# EAGLE design 9xVoice MikeB SMD v1.0c (EAGLE 6.5.0)
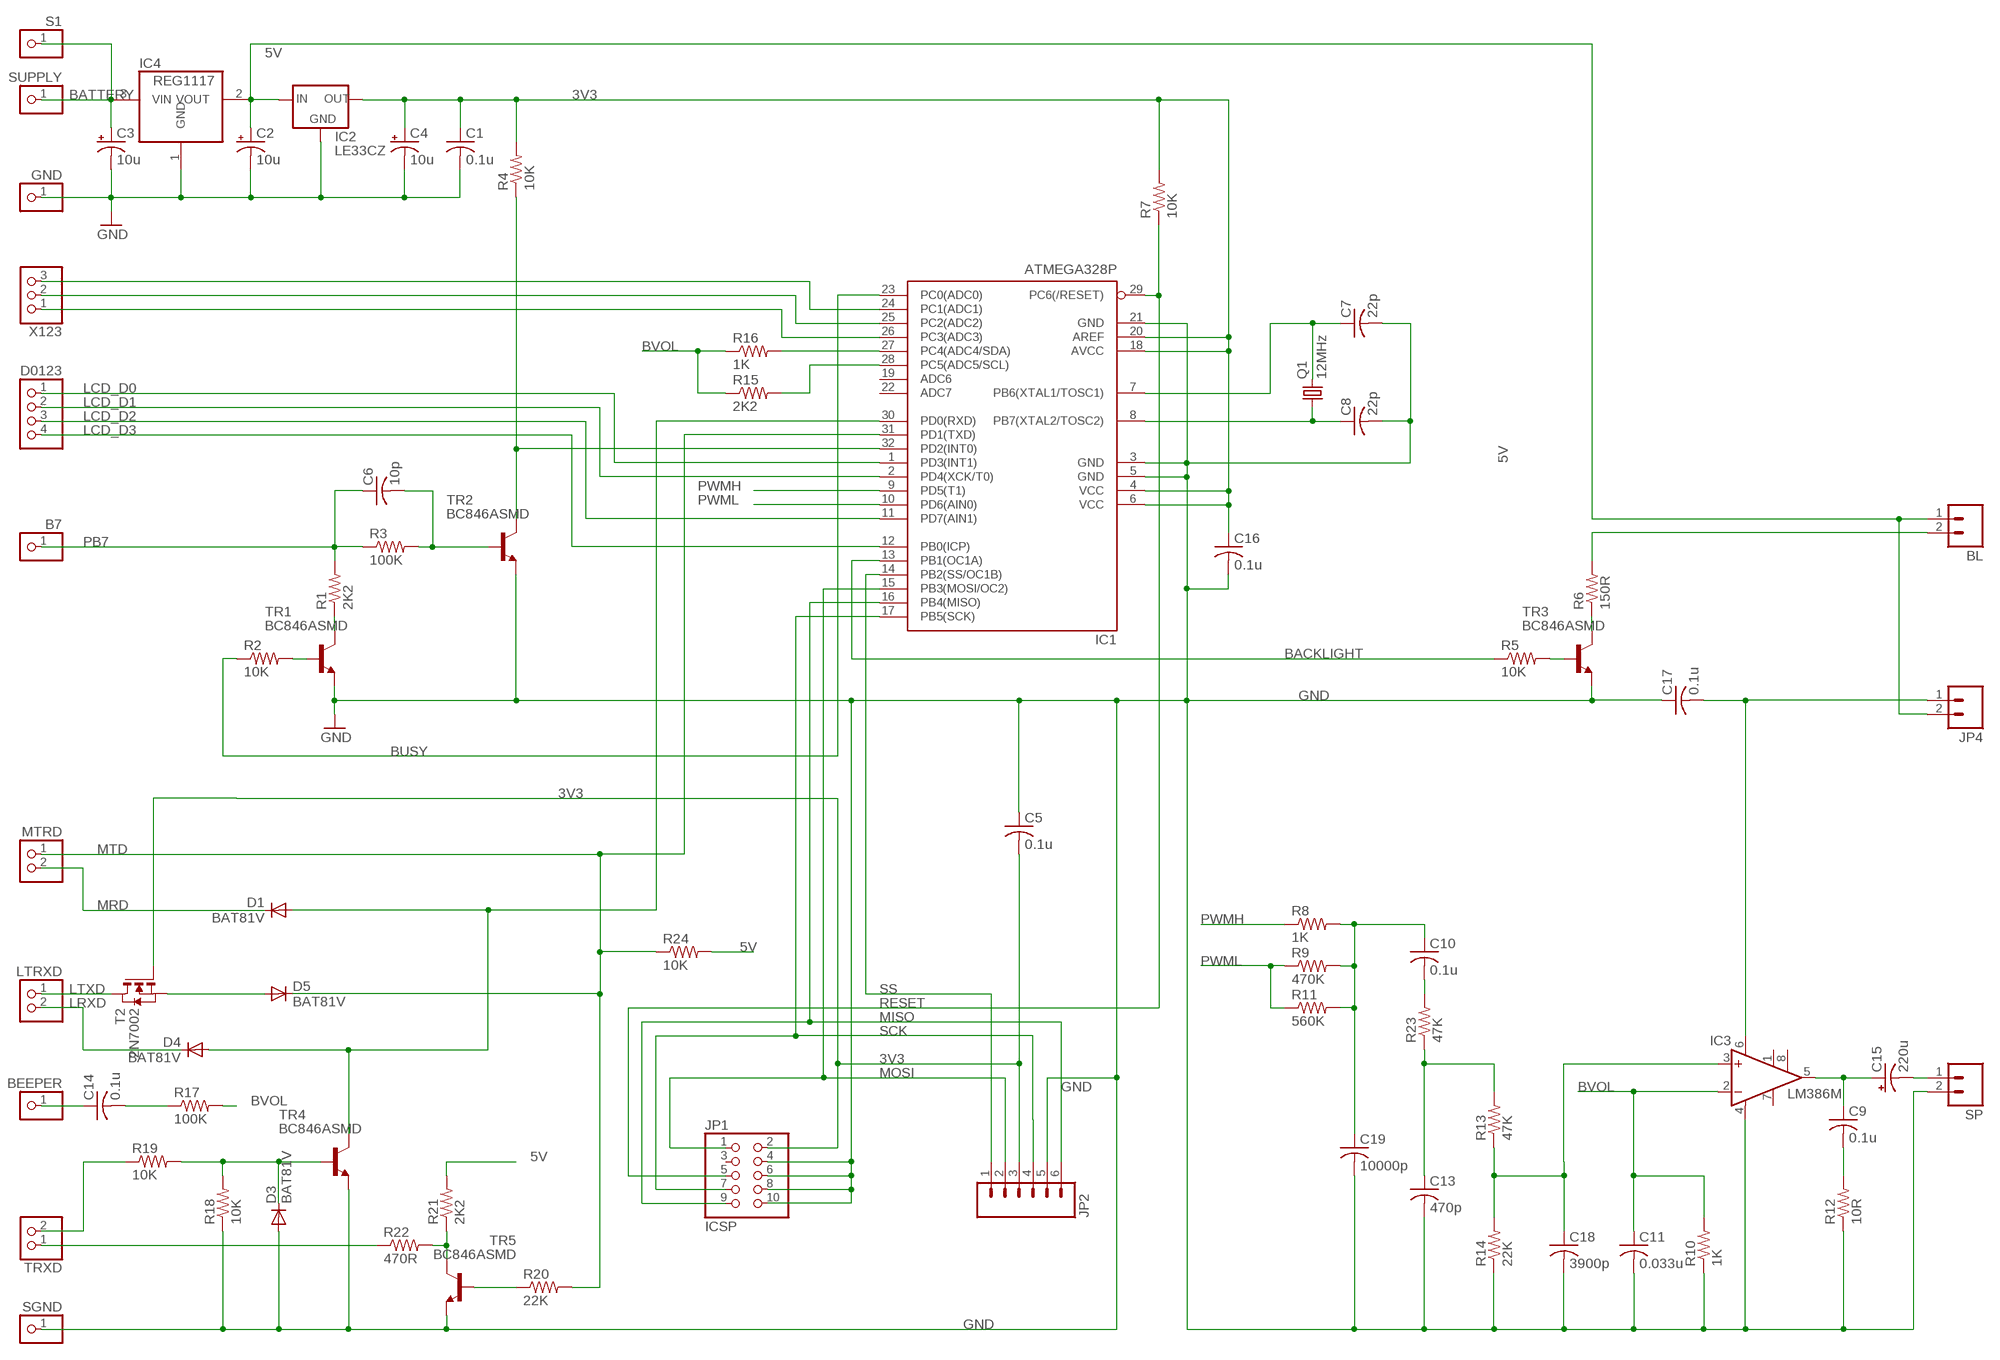
[diagram p0: schematic, sheet 1]

## Parts
B7  PINHD-1X1  [1X01]
BEEPER  PINHD-1X1  [1X01]
BL  M02PTH  [1X02]
C1  0.1u  C-USC1206  [C1206]
C2  10u  CPOL-USA/3216-18R  [A/3216-18R]
C3  10u  CPOL-USA/3216-18R  [A/3216-18R]
C4  10u  CPOL-USA/3216-18R  [A/3216-18R]
C5  0.1u  C-USC1206  [C1206]
C6  10p  C-USC1206  [C1206]
C7  22p  C-USC1206  [C1206]
C8  22p  C-USC1206  [C1206]
C9  0.1u  C-USC1206  [C1206]
C10  0.1u  C-USC1206  [C1206]
C11  0.033u  C-USC1206  [C1206]
C13  470p  C-USC1206  [C1206]
C14  0.1u  C-USC1206  [C1206]
C15  220u  CPOL-USCT7343  [CT7343]
C16  0.1u  C-USC1206  [C1206]
C17  0.1u  C-USC1206  [C1206]
C18  3900p  C-USC1206  [C1206]
C19  10000p  C-USC1206  [C1206]
D1  BAT81V  DIODE-SOD123  [SOD123]
D3  BAT81V  DIODE-SOD123  [SOD123]
D4  BAT81V  DIODE-SOD123  [SOD123]
D5  BAT81V  DIODE-SOD123  [SOD123]
D0123  PINHD-1X4  [1X04]
GND  PINHD-1X1  [1X01]
IC1  ATMEGA328P  MEGA8-AI  [TQFP32-08]
IC2  LE33CZ  XC63FPM  [SOT23]
IC3  LM386M  LM386M-1  [SO08]
IC4  REG1117  [SOT223]
JP1  ICSP  PINHD-2X5  [2X05]
JP2  M06SIP  [1X06]
JP4  M02PTH  [1X02]
LTRXD  PINHD-1X2  [1X02]
MTRD  PINHD-1X2  [1X02]
Q1  12MHz  7A  [2-SMD]
R1  2K2  R-US_R1206  [R1206]
R2  10K  R-US_R1206  [R1206]
R3  100K  R-US_R1206  [R1206]
R4  10K  R-US_R1206  [R1206]
R5  10K  R-US_R1206  [R1206]
R6  150R  R-US_R1206  [R1206]
R7  10K  R-US_R1206  [R1206]
R8  1K  R-US_R1206  [R1206]
R9  470K  R-US_R1206  [R1206]
R10  1K  R-US_R1206  [R1206]
R11  560K  R-US_R1206  [R1206]
R12  10R  R-US_R1206  [R1206]
R13  47K  R-US_R1206  [R1206]
R14  22K  R-US_R1206  [R1206]
R15  2K2  R-US_R1206  [R1206]
R16  1K  R-US_R1206  [R1206]
R17  100K  R-US_R1206  [R1206]
R18  10K  R-US_R1206  [R1206]
R19  10K  R-US_R1206  [R1206]
R20  22K  R-US_R1206  [R1206]
R21  2K2  R-US_R1206  [R1206]
R22  470R  R-US_R1206  [R1206]
R23  47K  R-US_R1206  [R1206]
R24  10K  R-US_R1206  [R1206]
S1  PINHD-1X1  [1X01]
SGND  PINHD-1X1  [1X01]
SP  M02PTH  [1X02]
SUPPLY  PINHD-1X1  [1X01]
T2  2N7002  NMOSSOT23  [SOT-23]
TR1  BC846ASMD  [SOT23]
TR2  BC846ASMD  [SOT23]
TR3  BC846ASMD  [SOT23]
TR4  BC846ASMD  [SOT23]
TR5  BC846ASMD  [SOT23]
TRXD  PINHD-1X2  [1X02]
X123  PINHD-1X3  [1X03]

## Nets
3V3: C1.1 C4.+ C5.2 C16.1 IC1.4(VCC) IC1.6(VCC) IC1.18(AVCC) IC1.20(AREF) IC2.2(OUT) JP1.2 JP2.3 R4.2 R7.2 T2.3(G)
5V: BL.1 C2.+ IC2.3(IN) IC4.2(VOUT) JP4.2 R21.2 R24.2
BACKLIGHT: IC1.13(PB1(OC1A)) R5.1
BATTERY: C3.+ IC4.3(VIN) S1.1 SUPPLY.1
BEEPER: BEEPER.1 C14.1
BUSY: IC1.23(PC0(ADC0)) R2.1
BVOL: C11.1 IC3.2(-IN) R10.2 R15.1 R16.1 R17.2
GND: C1.2 C2.- C3.- C4.- C5.1 C7.2 C8.2 C11.2 C13.2 C16.2 C17.1 C18.2 C19.2 D3.A GND.1 IC1.3(GND) IC1.5(GND) IC1.21(GND) IC2.1(GND) IC3.4(GND) IC4.1(GND) JP1.4 JP1.6 JP1.8 JP1.10 JP2.5 R10.1 R12.1 R14.1 R18.1 SGND.1 SP.2 TR1.2(E) TR2.2(E) TR3.2(E) TR4.2(E) TR5.2(E)
LCD_D0: D0123.1 IC1.1(PD3(INT1))
LCD_D1: D0123.2 IC1.2(PD4(XCK/T0))
LCD_D2: D0123.3 IC1.11(PD7(AIN1))
LCD_D3: D0123.4 IC1.12(PB0(ICP))
LRXD: D4.C LTRXD.2
LTXD: LTRXD.1 T2.1(D)
MISO: IC1.16(PB4(MISO)) JP1.9 JP2.6
MOSI: IC1.15(PB3(MOSI/OC2)) JP1.1 JP2.2
MRD: D1.C MTRD.2
MTD: D5.C IC1.31(PD1(TXD)) MTRD.1 R20.2 R24.1
N$1: C13.1 R13.2 R23.1
N$2: R21.1 R22.2 TR5.3(C)
N$3: R22.1 TRXD.1
N$4: R20.1 TR5.1(B)
N$5: IC1.28(PC5(ADC5/SCL)) R15.2
N$6: IC1.27(PC4(ADC4/SDA)) R16.2
N$10: R19.1 TRXD.2
N$11: D3.C R18.2 R19.2 TR4.1(B)
N$14: D5.A T2.2(S)
N$21: R1.1 TR1.3(C)
N$22: R2.2 TR1.1(B)
N$23: C6.2 R3.2 TR2.1(B)
N$25: C14.2 R17.1
N$26: R5.2 TR3.1(B)
N$27: R6.1 TR3.3(C)
N$28: C10.2 R23.2
N$29: IC1.32(PD2(INT0)) R4.1 TR2.3(C)
N$30: C8.1 IC1.8(PB7(XTAL2/TOSC2)) Q1.P$1
N$31: C7.1 IC1.7(PB6(XTAL1/TOSC1)) Q1.P$2
N$33: BL.2 R6.2
N$34: C9.1 C15.+ IC3.5(OUT)
N$35: C9.2 R12.2
N$36: C15.- SP.1
N$37: C17.2 IC3.6(VS) JP4.1
N$39: C10.1 C19.1 R8.2 R9.2 R11.2
N$40: C18.1 IC3.3(+IN) R13.1 R14.2
PB7: B7.1 C6.1 R1.2 R3.1
PWMH: IC1.9(PD5(T1)) R8.1
PWML: IC1.10(PD6(AIN0)) R9.1 R11.1
RESET: IC1.29(PC6(/RESET)) JP1.5 R7.1
RXD: D1.A D4.A IC1.30(PD0(RXD)) TR4.3(C)
SCK: IC1.17(PB5(SCK)) JP1.7 JP2.4
SS: IC1.14(PB2(SS/OC1B)) JP2.1
X1: IC1.26(PC3(ADC3)) X123.1
X2: IC1.25(PC2(ADC2)) X123.2
X3: IC1.24(PC1(ADC1)) X123.3
Unconnected: IC1.19(ADC6) IC1.22(ADC7) IC3.1(GAIN) IC3.7(BYPASS) IC3.8(GAIN) JP1.3

## Library data of the parts
B7 BEEPER GND S1 SGND SUPPLY = pinhead:PINHD-1X1: PIN HEADER
BL JP4 SP = SparkFun-Connectors:M02: Header 2 Standard 2-pin 0.1" header. Use with straight break away headers (SKU : PRT-00116), right angle break away headers (PRT-00553), swiss pins (PRT-00743), machine pins (PRT-00117), and female headers (PRT-00115). Molex polarized connector foot print use with SKU : PRT-08233 with associated crimp pins and housings.
C1 C5-C11 C13 C14 C16-C19 = jdc:C-US: CAPACITOR, American symbol
C2-C4 C15 = jdc:CPOL-US: POLARIZED CAPACITOR, American symbol
D1 D3-D5 = jdc:DIODE-: DIODE
D0123 = jdc:PINHD-1X4
IC1 = atmel:MEGA8: MICROCONTROLLER 8 Kbytes FLASH, 1 kbytes SRAM, 512 bytes EEPROM, USART, 6-channel 10 bit ADC, 2-channel 8 bit ADC Pin compatible with Atmega48, ATMega88, ATMega168 Source: avr.lbr; MPN: ATMEGA8-16AU; OC_FARNELL: 9171371; OC_NEWARK: 73M8863
IC2 = v-reg:XC63FP: Positiv Voltage Regulators www.torex.co.jp/english/product/pro02/pdf/0201_xc62fp.pdf
IC3 = jdc:LM386?-*: Low Voltage Audio Power Amplifier Source: http://cache.national.com/ds/LM/LM386.pdf
IC4 = burr-brown:REG1117: 800mA and 1A Low Dropout (LDO) Positive Regulator 1.8V, 2.5V, 2.85V, 3.3V, 5V, and Adj; MPN: REG1117; OC_FARNELL: 1097566; OC_NEWARK: 14P6981
JP1 = pinhead:PINHD-2X5: PIN HEADER
JP2 = SparkFun-Connectors:M06: Header 6 Standard 6-pin 0.1" header. Use with straight break away headers (SKU : PRT-00116), right angle break away headers (PRT-00553), swiss pins (PRT-00743), machine pins (PRT-00117), and female headers (PRT-00115). Molex polarized connector foot print use with SKU : PRT-08094 with associated crimp pins and housings. NOTES ON THE VARIANTS LOCK and LOCK_LONGPADS... This footprint was designed to help hold the alignment of a through-hole component (i.e. 6-pin header) while soldering it into place. You may notice that each hole has been shifted either up or down by 0.005 of an inch from it's more standard position (which is a perfectly straight line). This slight alteration caused the pins (the squares in the middle) to touch the edges of the holes. Because they are alternating, it causes a "brace" to hold the component in place. 0.005 has proven to be the perfect amount of "off-center" position when using our standard breakaway headers. Although looks a little odd when you look at the bare footprint, once you have a header in there, the alteration is very hard to notice. Also, if you push a header all the way into place, it is covered up entirely on the bottom side. This idea of altering the position of holes to aid alignment will be further integrated into the Sparkfun Library for other footprints. It can help hold any component with 3 or more connection pins.
LTRXD MTRD TRXD = jdc:PINHD-1X2
Q1 = jdc:7A
R1-R24 = jdc:R-US_: RESISTOR, American symbol
T2 = zetex:NMOSSOT23: MOS FET; OC_FARNELL: unknown; OC_NEWARK: unknown
TR1-TR4 = jdc:BC846*: NPN Transistor
TR5 = transistor-npn:BC846*: NPN Transistor
X123 = jdc:PINHD-1X3: PIN HEADER

## Board
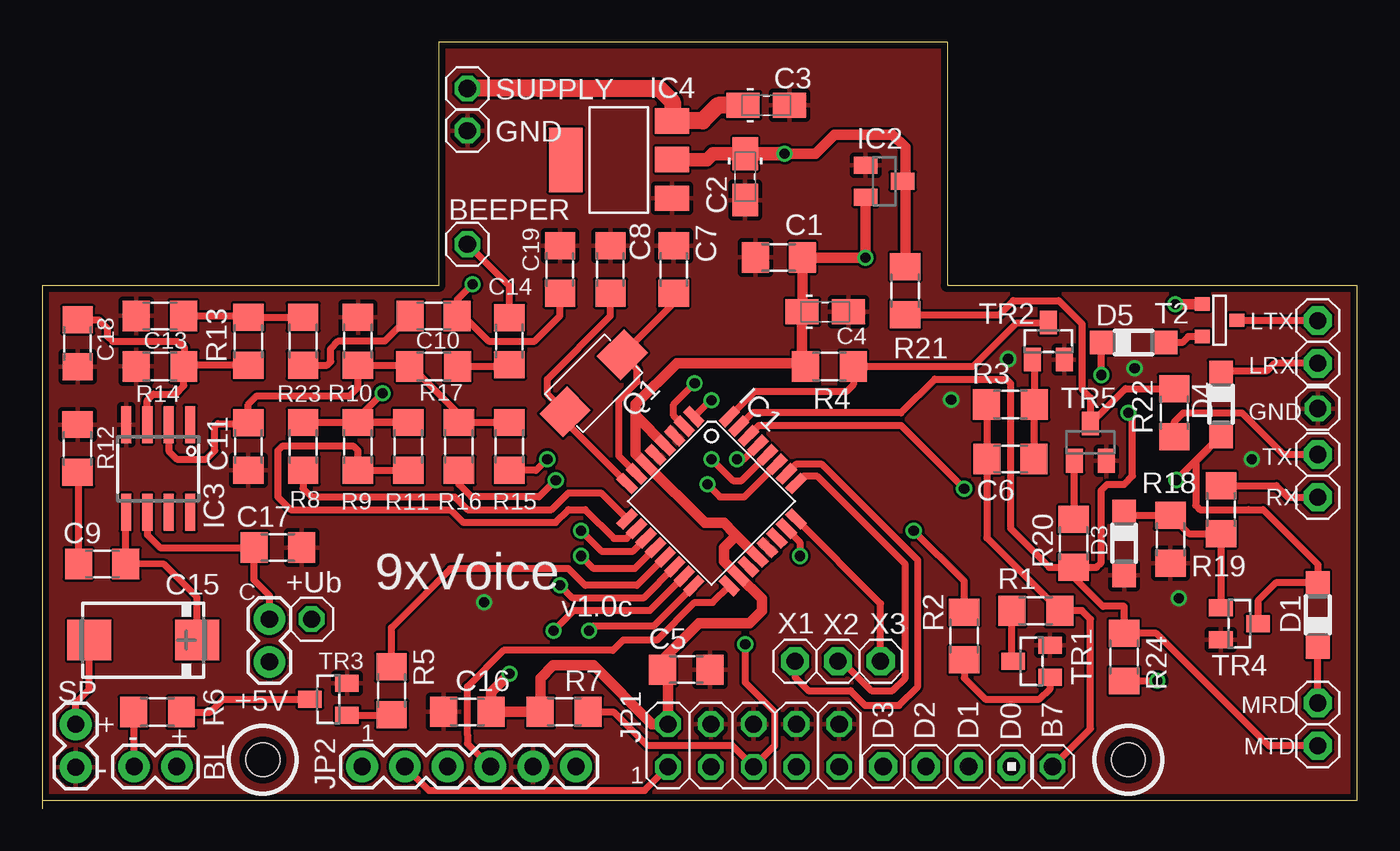
[diagram p1: board, top side]
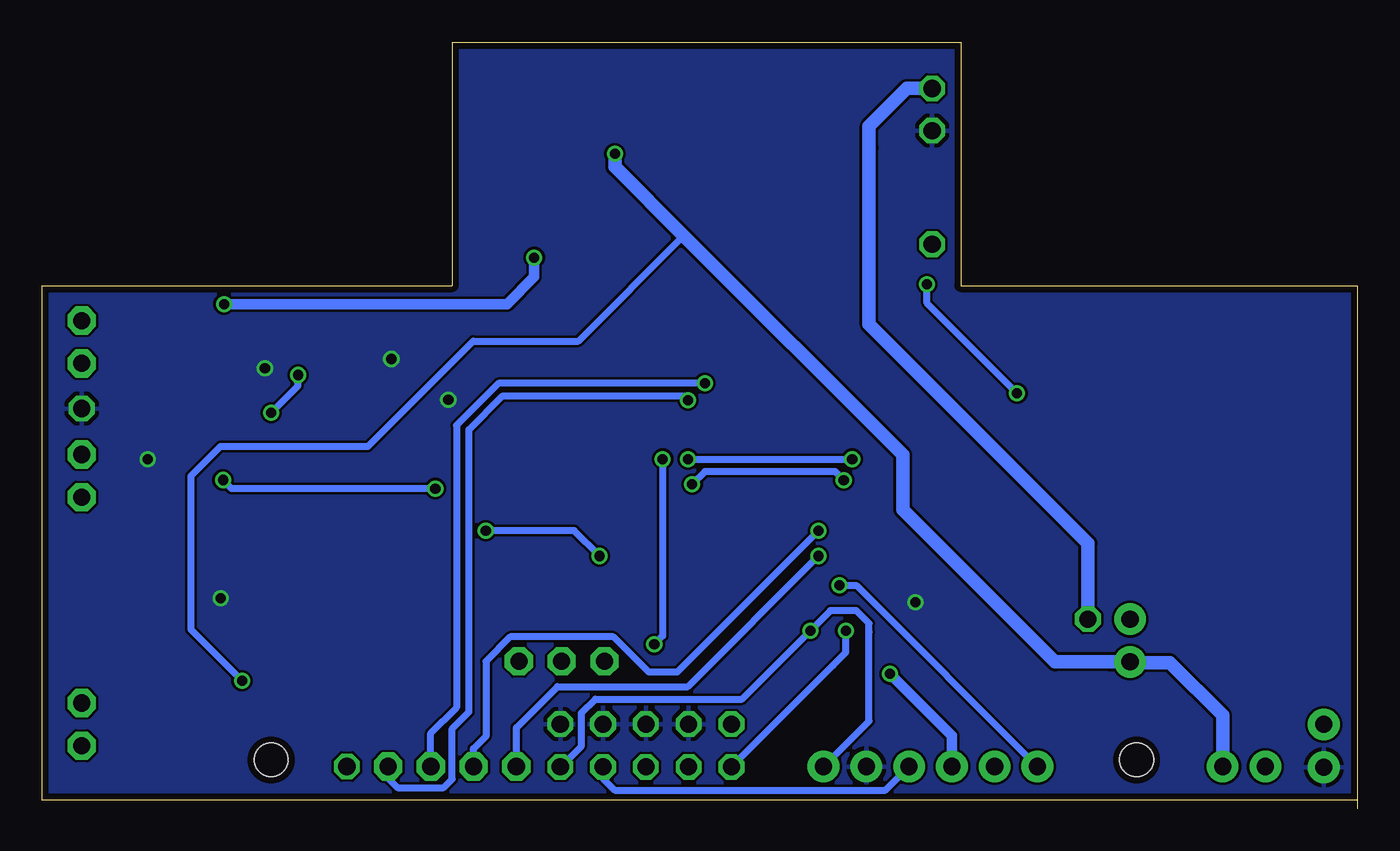
[diagram p2: board, bottom side, seen from below]

Size 78.1 x 45.5 mm. Coordinates in mm from the lower left corner, seen from the top.
Outline: 0,0.5 78.1,0.5 78.1,31.05 53.75,31.05 53.75,45.5 23.55,45.5 23.55,31.05 0,31.05 0,0.5
Outline: 0,0.5 0,0
Copper layers (1*16): Top 0.0356mm / dielectric 1.5011mm / Bottom 0.0356mm
Design rules "LaenPCBOrder *": minimum track width 6mil, minimum drill 13mil, track to track 6mil, track to pad 6mil, pad to pad 6mil, via to via 6mil, smd to smd 6mil, copper to edge 15mil, drill to drill 6mil, minimum pad ring 7mil, minimum via ring 7mil, stop-mask expansion 4mil, vias tented up to drill 24mil, thermal gap 10mil
Holes 2 mm at 13.1,2.9 64.5,2.9
tKeepout: area 11.1,0.9 to 15.1,4.9; area 62.5,0.9 to 66.5,4.9

### Footprints (pad centres in the part's own frame; a part is rotated, then mirrored left to right if it is on the bottom)
1X01 = drill 1.016 octagon: 1 0,0
1X02 = drill 1.016 pad 1.88: 1 0,0; 2 2.54,0
C1206 = smd 1.6 x 1.8: 1 -1.4,0; 2 1.4,0
A/3216-18R = smd 1.95 x 1.5: + 1.375,0; - -1.375,0
CT7343 = smd 2.6 x 2.4: + -3.2,0; - 3.2,0
SOD123 = smd 1.4 x 1.4: A 1.9,0; C -1.9,0
1X04 = drill 1.016 pad 1.676 octagon: 1 -3.81,0; 2 -1.27,0; 3 1.27,0; 4 3.81,0
TQFP32-08 = smd 1.27 x 0.559: 1 -4.293,2.8; 2 -4.293,2; 3 -4.293,1.2; 4 -4.293,0.4; 5 -4.293,-0.4; 6 -4.293,-1.2; 7 -4.293,-2; 8 -4.293,-2.8; 17 4.293,-2.8; 18 4.293,-2; 19 4.293,-1.2; 20 4.293,-0.4; 21 4.293,0.4; 22 4.293,1.2; 23 4.293,2; 24 4.293,2.8 | smd 0.559 x 1.27: 9 -2.8,-4.293; 10 -2,-4.293; 11 -1.2,-4.293; 12 -0.4,-4.293; 13 0.4,-4.293; 14 1.2,-4.293; 15 2,-4.293; 16 2.8,-4.293; 25 2.8,4.293; 26 2,4.293; 27 1.2,4.293; 28 0.4,4.293; 29 -0.4,4.293; 30 -1.2,4.293; 31 -2,4.293; 32 -2.8,4.293
SOT23 = smd 1 x 1.4: 1 -0.95,-1.1; 2 0.95,-1.1; 3 0,1.1
SO08 = smd 0.6 x 2.2: 1 -1.905,-2.6; 2 -0.635,-2.6; 3 0.635,-2.6; 4 1.905,-2.6; 5 1.905,2.6; 6 0.635,2.6; 7 -0.635,2.6; 8 -1.905,2.6
SOT223 = smd 1.499 x 2.007: 1 -2.261,-3.15; 2 0.025,-3.15; 3 2.311,-3.15 | smd 3.81 x 2.007: 4 0,3.15
2X05 = drill 1.016 octagon: 1 -5.08,-1.27; 2 -5.08,1.27; 3 -2.54,-1.27; 4 -2.54,1.27; 5 0,-1.27; 6 0,1.27; 7 2.54,-1.27; 8 2.54,1.27; 9 5.08,-1.27; 10 5.08,1.27
1X06 = drill 1.016 pad 1.88: 1 0,0; 2 2.54,0; 3 5.08,0; 4 7.62,0; 5 10.16,0; 6 12.7,0
1X02' = drill 1.016 pad 1.676 octagon: 1 -1.27,0; 2 1.27,0
2-SMD = smd 2.3 x 2: P$1 2.4,0; P$2 -2.4,0
R1206 = smd 1.6 x 1.803: 1 -1.422,0; 2 1.422,0
SOT-23 = smd 0.787 x 0.889: 1 0.025,-1.016; 2 -0.94,1.016; 3 0.991,1.016
1X03 = drill 1.016 pad 1.676 octagon: 1 -2.54,0; 2 0,0; 3 2.54,0

### Placement (x,y rotation side)
B7  60,2.5 0 top
BEEPER  25.25,33.5 0 top
BL  8,2.5 180 top
C1  43.75,32.72 180 top
C2  41.75,37.5 90 top
C3  43,41.75 180 top
C4  46.5,29.5 180 top
C5  38.25,8.25 180 top
C6  57.5,20.75 0 top
C7  37.5,32 90 top
C8  33.75,32 90 top
C9  3.57,14.53 180 top
C10  23.25,29.25 180 top
C11  12.25,21.5 270 top
C13  7,29.25 180 top
C14  27.75,27.75 270 top
C15  6,10 180 top
C16  25.25,5.75 180 top
C17  14,15.5 180 top
C18  2.11,27.62 270 top
C19  30.75,32 90 top
D1  75.75,11.5 90 top
D3  64.25,15.75 270 top
D4  70,24 270 top
D5  64.81,27.67 0 top
D0123  53.75,2.5 180 top
GND  25.25,40.25 0 top
IC1  39.75,18.25 315 top
IC2  50,37.25 270 top
IC3  6.89,20.19 180 top
IC4  34.25,38.5 90 top
JP1  42.25,3.75 0 top
JP2  19,2.5 0 top
JP4  13.5,11.25 270 top
LTRXD  [1X02']  75.75,27.7 270 top
MTRD  [1X02']  75.75,5 90 top
Q1  32.75,25.25 225 top
R1  59,11.75 0 top
R2  54.75,10.25 270 top
R3  57.5,24 0 top
R4  46.75,26.25 180 top
R5  20.75,7 270 top
R6  6.85,5.73 180 top
R7  31,5.75 180 top
R8  15.5,21.5 90 top
R9  18.75,21.5 90 top
R10  18.75,27.75 270 top
R11  21.75,21.5 90 top
R12  2.11,21.38 270 top
R13  12.25,27.75 90 top
R14  7,26.25 0 top
R15  27.75,21.5 270 top
R16  24.75,21.5 270 top
R17  23.25,26.25 180 top
R18  67,16 90 top
R19  70,17.75 270 top
R20  61.25,15.75 270 top
R21  51.25,30.75 90 top
R22  67.23,23.51 90 top
R23  15.5,27.75 270 top
R24  64.25,9 270 top
S1  16,11.25 0 top
SGND  75.75,23.75 0 top
SP  2,5 270 top
SUPPLY  25.25,42.75 0 top
T2  69.92,28.96 90 top
TR1  58.75,8.75 90 top
TR2  59.75,27.75 0 top
TR3  17,6.5 90 top
TR4  71.09,10.98 270 top
TR5  62.25,21.75 0 top
TRXD  [1X02']  75.75,19.75 270 top
X123  47.25,8.75 0 top

### Tracks (layer width: path | path; a pad name or v marks a point on that pad's centre or on a via)
3V3  (via drill 0.6)
  Top 0.61: 45.15,29.02 C4.+ | C4.+ 45.12,26.45 | 45.12,26.45 R4.2 | R7.2 C16.1 26.65,6.9 v27.75,8 | R7.2 | v67.3,29.95 T2.3 | 45.12,26.45 37.7,26.45 35.25,24 35.25,23.25 | R7.2 29.59,5.76 29.59,7.75 30.34,8.5 32.75,8.5 36.23,5.02 JP1.2 37.17,7.93 C5.2 36.85,8.85 39,11 42,11 42.74,11.74 42.74,12.45 41.39,13.8 IC1.18 40.5,14.67 40.5,15.5 41.09,16.09 41.09,16.34 | IC1.20 41.09,16.34 | 41.09,16.34 41.09,16.36 40.49,16.96 39.35,16.96 IC1.6 35.25,21.05 35.25,23.25 | IC1.4 35.32,23.25 35.25,23.25 | IC2.2 48.88,36.28 v48.88,32.71 C1.1 45.15,29.02 | 45.15,29.02 C4.+
  Bottom 0.61: v67.3,29.95 50.5,29.95 48.88,31.57 v48.88,32.71 | JP2.3 24.08,4.33 v27.75,8
5V  (via drill 0.6)
  Top 0.406: R24.2 66.23,7.58 v66.23,7.6
  Top 0.61: IC2.3 51.25,37.1 R21.2 51.25,39.25 50.5,40 47.05,40 45.92,38.87 v44.09,38.87 v44.09,38.88
  Top 0.813: IC4.2 39.48,38.52 39.83,38.88 C2.+ v44.09,38.88 | R21.2 | IC2.3 51.25,37.25
  Bottom 0.406: v66.23,7.6 69.25,10.62 69.25,19.25 69.25,19.75 67.5,21.5 58.75,21.5 52.5,27.75 46.25,27.75 40,34
  Bottom 0.813: BL.1 8,5.53 11.14,8.67 13.46,8.67 JP4.2 14.71,8.71 17.96,8.71 27,17.75 27,21 40,34 44.09,38.09 v44.09,38.88
BACKLIGHT
  Top 0.406: R5.1 20.75,10.75 24.25,14.25 31.25,14.25 32.25,13.25 35.32,13.25 IC1.13
BATTERY
  Top 1.016: C3.+ 40.14,41.75 39.22,40.83 37.42,40.83 IC4.3 37.42,40.83 37.42,41.95 36.62,42.75 29.5,42.75 SUPPLY.1
  Bottom 0.813: S1.1 16,15.75 26.25,26 29,28.75 29,39.25 29,40.5 26.75,42.75 25.75,42.75 SUPPLY.1
BEEPER
  Top 0.406: C14.1 27.75,31 BEEPER.1
BUSY  (via drill 0.6)
  Top 0.406: IC1.23 45,15.83 v45,15 | R2.1 54.75,13.5 v51.75,16.5
  Bottom 0.406: v45,15 46.5,16.5 v51.75,16.5
BVOL
  Top 0.406: IC3.2 7.53,21.23 8,20.75 9.75,20.75 10.25,21.25 10.25,22.66 10.45,22.86 12.21,22.86 C11.1 12.25,24 12.75,24.5 18.25,24.5 18.75,25 R10.2 21.75,26.33 R17.2 21.92,26.25 24.74,23.43 24.74,22.93 R16.1 R15.1
GND  (via drill 0.6)
  other vias: 26.25,12.25 67.5,12.5 57.36,26.69 64.87,26.15 53.98,24.28 71.82,20.74
  pour Top: 0,0.5 78.1,0.5 78.1,27.69 78.1,45.5 49.35,45.5 0,45.5 0,27.07
  pour Bottom: 0,0.5 78.1,0.5 78.1,2.52 78.1,45.49 51.22,45.49 0,45.49
LCD_D0  (via drill 0.6)
  Top 0.406: v39.75,24.25 39.68,24.25 IC1.1
  Bottom 0.406: v39.75,24.25 40,24.5 50.75,24.5 52.75,22.5 52.75,5.75 53.75,4.75 53.75,1.75 54.25,1.25 57,1.25 57.56,1.81 D0123.1
LCD_D1  (via drill 0.6)
  Top 0.406: IC1.2 37.5,23.33 37.5,24 v38.75,25.25
  Bottom 0.406: v38.75,25.25 51,25.25 53.5,22.75 53.5,6 55.02,4.48 D0123.2
LCD_D2  (via drill 0.6)
  Top 0.406: IC1.11 35.05,15.25 33.25,15.25 v32,16.5
  Bottom 0.406: v32,16.5 40.39,8.11 40.4,8.12 42.09,8.12 44.17,10.2 50.3,10.2 51.75,8.75 51.75,4.29 52.48,3.56 D0123.3
LCD_D3  (via drill 0.6)
  Top 0.406: IC1.12 35.18,14.25 32.75,14.25 v32,15
  Bottom 0.406: v32,15 39.75,7.25 47.5,7.25 49.94,4.81 D0123.4
LRXD
  Top 0.406: D4.C 70.1,26 72.75,26 73.18,26.43 LTRXD.2
LTXD
  Top 0.406: T2.1 75.73,28.98 LTRXD.1
MISO  (via drill 0.6)
  Top 0.406: IC1.16 36.3,10.84 32.74,10.84 v32.47,10.57
  Bottom 0.406: JP1.9 47.3,2.48 46.07,3.71 46.07,5.68 45.25,6.5 36.54,6.5 v32.47,10.57 31.29,11.75 29.75,11.75 29,11 29,10.5 29,5.2 JP2.6
MOSI  (via drill 0.6)
  Top 0.406: IC1.15 36.08,11.75 31.56,11.75 v30.38,10.57 | JP2.2 22.95,1.09 35.12,1.09 35.78,1.09 JP1.1
  Bottom 0.406: JP1.1 31.14,8.51 30.38,9.27 v30.38,10.57
MRD
  Top 0.406: MTRD.2 D1.C
MTD  (via drill 0.6)
  Top 0.406: R20.2 62.61,14.33 62.89,14.61 62.89,18.89 63.25,19.25 64.25,19.25 64.75,19.75 64.75,23.25 v64.5,23.5 | v62.9,25.74 v62.91,25.75 D5.C | R20.2 59.81,14.32 57.5,16.63 57.5,25.25 57.25,25.5 53,25.5 51,23.5 42.17,23.5 IC1.31 | R20.2 61,14.08 61,14 63,12 64.25,12 R24.1 64.26,10.41 66.16,10.41 72.84,3.73 MTRD.1
  Bottom 0.406: v64.5,23.5 62.9,25.1 v62.9,25.74
N$1
  Top 0.406: C13.1 12.17,29.25 R13.2 R23.1
N$2
  Top 0.406: R22.2 64.33,24.93 TR5.3 62.25,24.4 61.75,24.9 61.75,28.78 60.37,30.16 57.66,30.16 56.83,29.33 R21.1
N$3
  Top 0.406: R22.1 67.23,22.98 67.75,23.5 71.25,23.5 73.73,21.02 TRXD.1
N$4
  Top 0.406: TR5.1 61.25,20.6 R20.1
N$5  (via drill 0.6)
  Top 0.406: v30,20.75 29.33,20.08 R15.2 | IC1.28 41.53,19.47 41.03,19.47 v39.75,20.75
  Bottom 0.406: v39.75,20.75 v30,20.75
N$6  (via drill 0.6)
  Top 0.406: v30.5,19.5 29.5,18.5 25.5,18.5 24.75,19.25 R16.2 | IC1.27 41.7,18.5 40.25,18.5 v39.5,19.25
  Bottom 0.406: v30.5,19.5 31,20 38.75,20 v39.5,19.25
N$10
  Top 0.406: R19.1 73.29,19.17 73.98,18.48 TRXD.2
N$11
  Top 0.406: D3.C 64.48,17.42 R18.2 68.09,16.33 R19.2 TR4.1
N$14
  Top 0.406: T2.2 68.06,28.02 67.7,27.66 D5.A
N$21
  Top 0.406: TR1.3 57.58,8.82 R1.1
N$22
  Top 0.406: 59.92,7.73 TR1.1 59.86,7.13 59.23,6.5 56,6.5 54.75,7.75 R2.2
N$23
  Top 0.406: TR2.1 58.92,26.53 R3.2 58.9,23.98 C6.2
N$25
  Top 0.406: R17.1 27.65,26.25 C14.2
N$26
  Top 0.406: TR3.1 20.72,5.55 R5.2
N$27
  Top 0.406: R6.1 9.98,5.73 10.75,6.5 TR3.3
N$28
  Top 0.406: R23.2 16.93,26.33 17.14,26.54 17.14,27.31 17.59,27.76 20.36,27.76 C10.2
N$29
  Top 0.406: TR2.3 57.88,28.84 55.29,26.25 R4.1 48.17,25.17 47.75,24.75 42.29,24.75 IC1.32
N$30
  Top 0.406: IC1.8 31.05,22.99 Q1.P$1 30,24.61 30,25.5 33.75,29.25 C8.1
N$31
  Top 0.406: IC1.7 34.25,20.92 34.25,24.25 35.33,25.33 35.33,26.08 34.46,26.95 Q1.P$2 37.5,30 C7.1
N$33
  Top 0.406: BL.2 5.46,5.7 R6.2
N$34
  Top 0.406: C15.+ 9.2,12.55 7.25,14.5 C9.1 4.97,17.57 IC3.5
N$35
  Top 0.406: C9.2 2.17,19.9 R12.2
N$36
  Top 0.406: SP.1 2,6.29 2.81,7.1 C15.-
N$37
  Top 0.406: JP4.1 13.5,12.64 12.58,13.56 12.58,15.48 C17.2 7,15.5 6.25,16.24 IC3.6
N$39  (via drill 0.6)
  Top 0.406: R8.2 R9.2 R11.2 18.83,22.92 18.75,23 18.75,23.2 v20.21,24.66 | v25.56,31.12 24.65,30.21 C10.1 25,29.25 26.5,27.75 29.25,27.75 30.75,29.25 C19.1
  Bottom 0.406: v20.21,24.66 25.56,30.01 v25.56,31.12
N$40
  Top 0.406: R13.1 8.5,26.33 R14.2 | C18.1 3.37,29.02 3.86,28.53 3.86,28.05 4.18,27.73 8.08,27.73 8.44,27.37 8.44,26.27 R14.2 | IC3.3 6.25,24.25 6.5,24.5 6.61,24.61 7.66,24.61 7.92,24.61 8.42,25.11 R14.2
PB7
  Top 0.406: R3.1 56.1,23.98 C6.1 56.1,16.07 R1.2 61.75,11.75 62.25,11.25 62.25,4.75 B7.1
PWMH
  Top 0.406: R8.1 15.5,19 16,18.5 24.5,18.5 25.25,17.75 30.25,17.75 31.25,18.75 33.18,18.75 IC1.9 34.7,17.2
PWML
  Top 0.406: 35.28,16.63 IC1.10 34.71,16.04 33.96,16.04 32.25,17.75 31.25,17.75 30.5,17 25,17 24.25,17.75 14.75,17.75 14,18.5 14,21.25 14.25,21.5 18.5,21.5 18.75,21.25 R9.1 R11.1
RESET  (via drill 0.6)
  Top 0.406: R7.1 33.93,5.75 35.92,3.76 40.97,3.76 JP1.5 43.5,3.73 43.5,5.75 41.75,7.5 v41.75,9.75 | IC1.29 41.68,20.75 v41.25,20.75
  Bottom 0.406: v41.25,20.75 41.25,10.25 v41.75,9.75
RXD  (via drill 0.6)
  Top 0.406: v54.75,19 51,22.75 42.55,22.75 IC1.30 | v67.36,19.51 70,22.15 D4.A 68.5,20.6 68.5,18 68.75,17.75 71.65,17.75 72.5,17.75 75.75,14.5 D1.A 73.25,13.4 72.19,12.34 TR4.3
  Bottom 0.406: v54.75,19 66.85,19 v67.36,19.51
SCK
  Top 0.406: IC1.17 39.82,12.25 38.75,12.25 36.5,10 34.5,10 33.89,9.39 27.41,9.39 25.26,7.24 25.26,4.4 25.26,3.86 JP2.4
  Bottom 0.406: JP1.7 44.79,1.79 44.1,1.1 28.02,1.1 JP2.4
SS  (via drill 0.6)
  Top 0.406: IC1.14 35.7,12.5 31.5,12.5 v30.75,13.25
  Bottom 0.406: v30.75,13.25 29.75,13.25 JP2.1
X1
  Top 0.406: IC1.26 44.76,20.43 46.32,20.43 52,14.75 52,7.25 50.88,6.13 48.87,6.13 48,7 45.5,7 44.71,7.79 X123.1
X2
  Top 0.406: IC1.25 45.21,19.75 46,19.75 51.25,14.5 51.25,7.75 50.5,7 49.25,7 47.5,8.75 X123.2
X3
  Top 0.406: X123.3 49.79,12.17 IC1.24

### Text on the board
tNames: LTX | LRX | GND | TX | RX | +Ub | C | 9xVoice | v1.0c | X1 | X2 | X3 | MRD | +5V | + | 1 | D3 | D2 | D1 | D0 | MTD | - | + | - | 1